# Altium schematic sheet E-18 M.2.SchDoc: FRDM-IMX93 (part 2 of 2)
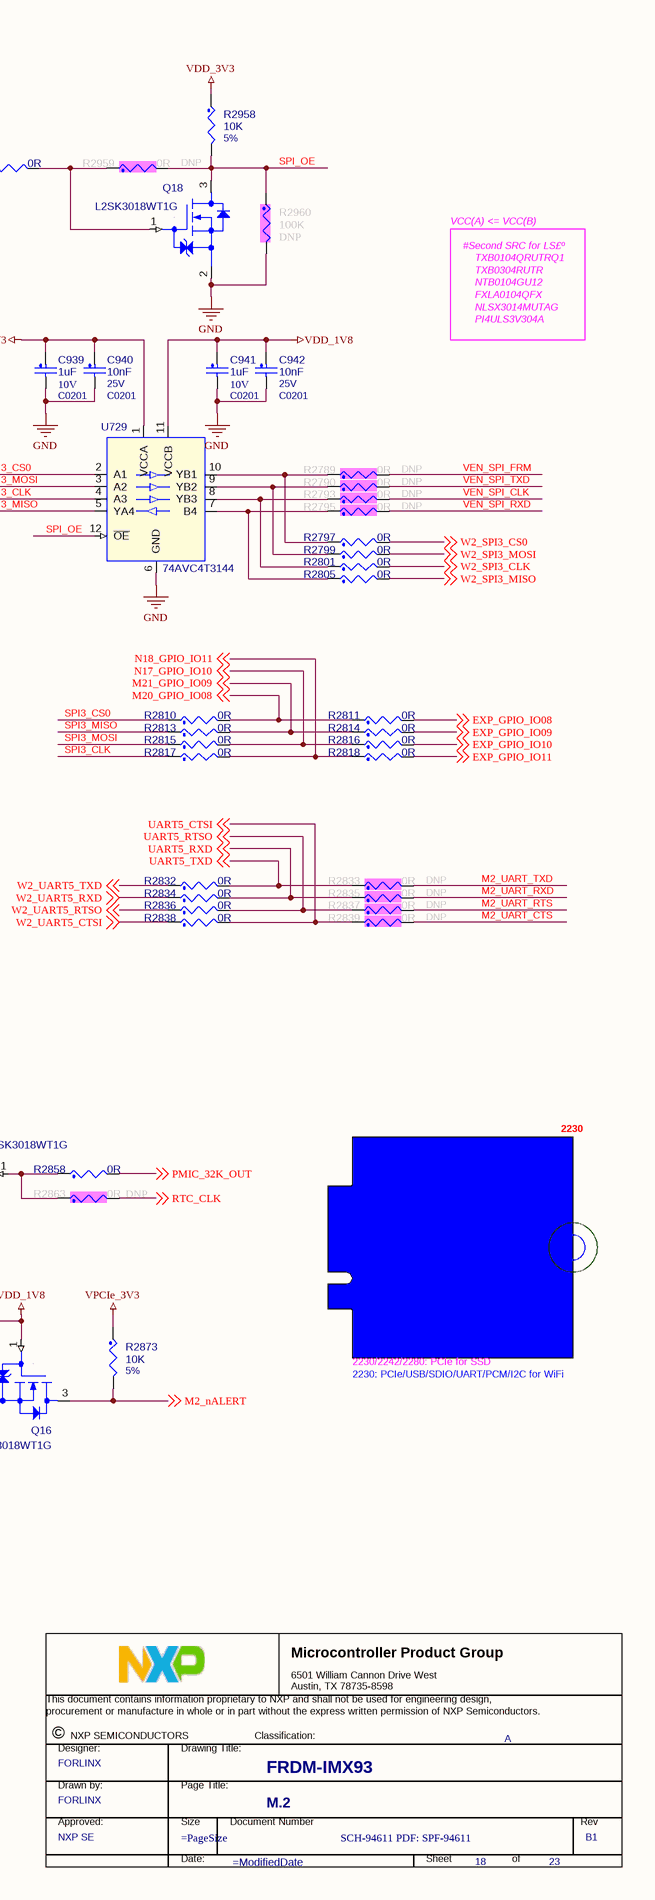
[diagram p2: E-18 M.2.SchDoc, right]

## Library data of the parts
* = TitleBlock_MCPG: Classification: Public, Company Internal/Proprietary, Company Confidential,  Company Secret; OrgName: NXP Semiconductor; OrgAddr1: NO. 192 Liangjing Rd. Pudong New Area, ShangHai; Page Size: =PageSize; Page Create Date: March  8, 1995; Designer: FORLINX; Page Modify Date: =ModifiedDate
BH1 = MOUNT_HOLE: M2mm,long 4mm; Part Reference: BH1; CLASS: IC; CAD_APPROVED: Yes; MFG_NAME01: SINHOO; MFG_PN01: M2*4mm; Value: SMTSO-M2.5-5ET; HEIGHT: 5.13MM; ROHS: Yes; PCB Footprint: mh244-166t_202h
C927 = CAP_NP: 0201,100nF,25V,+/-10%,X5R; Part Reference: C927; CLASS: DISCRETE; FPLIST: CC0402_25,CC0402_HD,0402_CC,capc0402_l; CAD_APPROVED: Yes; MFG_PN01: 0201X104K250NT; MFG_NAME01: FENGHUA; Tolerance: 10%; Value: 100nF; HEIGHT: 0.55MM; ROHS: Yes; PCB Footprint: C0201
C928 = CAP_NP: 0805,47uF,10V,+/-20%,X5R; Part Reference: C928; CLASS: DISCRETE; FPLIST: CC1210,1210_CC; CAD_APPROVED: Yes; MFG_PN01: GRM21BR61A476ME15L; MFG_NAME01: MURATA; Tolerance: 20%; Value: 47uF; Package Size: 1210; HEIGHT: 2.8MM; ROHS: Yes; PCB Footprint: C0805
C929 = CAP_NP: 0402,1nF,50V,+/-10%,X7R; Part Reference: C929; CLASS: DISCRETE; Tolerance: 5%; MFG_NAME01: FENGHUA; MFG_PN01: 0402B102K500NT; CAD_APPROVED: Yes; FPLIST: CC0402_25,CC0402_HD,0402_CC; Value: 1000pF; ROHS: Yes; HEIGHT: 0.55MM; PCB Footprint: C0402
C930 = CAP_NP: 0603,22uF,6.3V,+/-20%,X5R; Part Reference: C930; CLASS: DISCRETE; Tolerance: 20%; MFG_NAME01: SAMSUNG; MFG_PN01: CL10A226MQ8NRNC; CAD_APPROVED: Yes; FPLIST: CC0805_OV,CC0805,0805_CC; Value: 22uF; ROHS: Yes; HEIGHT: 1.45MM; PCB Footprint: C0603
C931 = CAP_NP: 0603,22uF,6.3V,+/-20%,X5R; Part Reference: C931; CLASS: DISCRETE; Tolerance: 20%; MFG_NAME01: SAMSUNG; MFG_PN01: CL10A226MQ8NRNC; CAD_APPROVED: Yes; FPLIST: CC0805_OV,CC0805,0805_CC; Value: 22uF; ROHS: Yes; HEIGHT: 1.45MM; PCB Footprint: C0603
C932 = CAP_NP: 0201,100nF,25V,+/-10%,X5R; Part Reference: C932; CLASS: DISCRETE; MFG_PN01: 0201X104K250NT; MFG_NAME01: FENGHUA; CAD_APPROVED: Yes; Tolerance: 10%; FPLIST: CC0402_25,CC0402_HD,0402_CC,capc0402_l; Value: 100nF; ROHS: Yes; HEIGHT: 0.55MM; PCB Footprint: C0201
C933 = CAP_NP: 0402,1nF,50V,+/-10%,X7R; Part Reference: C933; CLASS: DISCRETE; FPLIST: CC0402_25,CC0402_HD,0402_CC; CAD_APPROVED: Yes; MFG_PN01: 0402B102K500NT; MFG_NAME01: FENGHUA; Tolerance: 5%; Value: 1000pF; HEIGHT: 0.55MM; ROHS: Yes; PCB Footprint: C0402
C934 = CAP_NP: 0402,100nF,50V,+/-10%,X5R; Part Reference: C934; CLASS: DISCRETE; Tolerance: 10%; MFG_NAME01: FENGHUA; MFG_PN01: 0402X104K500NT; CAD_APPROVED: Yes; FPLIST: CC0402_25,CC0402_HD,0402_CC,capc0402_l; Value: 100nF; ROHS: Yes; HEIGHT: 0.55MM; PCB Footprint: C0402
C935 = CAP_NP: 0201,1uF,10V,+/-20%,X5R; Part Reference: C935; CLASS: DISCRETE; Tolerance: 10%; SIGNAL_MODEL: DEFAULT_CAPACITOR_1e+06pF_2_1; MFG_NAME01: SAMSUNG; MFG_PN01: CL03A105MP3NSNC; CAD_APPROVED: Yes; FPLIST: CC0402_25,CC0402_HD,0402_CC,capc0402_l; Value: 1uF; ROHS: Yes; HEIGHT: 0.55 MM; TOL: 10%; voltage rating: 10V; PCB Footprint: C0201
C936 = CAP_NP: 0201,10nF,25V,+/-10%,X7R; Part Reference: C936; CLASS: DISCRETE; Tolerance: 10%; MFG_NAME01: FENGHUA; MFG_PN01: 0201B103K250NT; Temp_Range: -55¡ãC - 85¡ãC; CAD_APPROVED: Yes; FPLIST: CC0402_25,CC0402_HD,0402_CC,capc0402_l; Value: 10nF; ROHS: Yes; HEIGHT: 0.55MM; PCB Footprint: C0201
C937 = CAP_NP: 0201,10nF,25V,+/-10%,X7R; Part Reference: C937; CLASS: DISCRETE; Tolerance: 10%; MFG_NAME01: FENGHUA; MFG_PN01: 0201B103K250NT; Temp_Range: -55¡ãC - 85¡ãC; CAD_APPROVED: Yes; FPLIST: CC0402_25,CC0402_HD,0402_CC,capc0402_l; Value: 10nF; ROHS: Yes; HEIGHT: 0.55MM; PCB Footprint: C0201
C938 = CAP_NP: 0201,1uF,10V,+/-20%,X5R; Part Reference: C938; CLASS: DISCRETE; Tolerance: 10%; SIGNAL_MODEL: DEFAULT_CAPACITOR_1e+06pF_2_1; MFG_NAME01: SAMSUNG; MFG_PN01: CL03A105MP3NSNC; CAD_APPROVED: Yes; FPLIST: CC0402_25,CC0402_HD,0402_CC,capc0402_l; Value: 1uF; ROHS: Yes; HEIGHT: 0.55 MM; TOL: 10%; voltage rating: 10V; PCB Footprint: C0201
C939 = CAP_NP: 0201,1uF,10V,+/-20%,X5R; Part Reference: C939; CLASS: DISCRETE; Tolerance: 10%; SIGNAL_MODEL: DEFAULT_CAPACITOR_1e+06pF_2_1; MFG_NAME01: SAMSUNG; MFG_PN01: CL03A105MP3NSNC; CAD_APPROVED: Yes; FPLIST: CC0402_25,CC0402_HD,0402_CC,capc0402_l; Value: 1uF; ROHS: Yes; HEIGHT: 0.55 MM; TOL: 10%; voltage rating: 10V; PCB Footprint: C0201
C940 = CAP_NP: 0201,10nF,25V,+/-10%,X7R; Part Reference: C940; CLASS: DISCRETE; FPLIST: CC0402_25,CC0402_HD,0402_CC; CAD_APPROVED: Yes; MFG_PN01: 0201B103K250NT; MFG_NAME01: FENGHUA; Tolerance: 10%; Value: 10nF; HEIGHT: 0.74 MM; ROHS: Yes; PCB Footprint: C0201
C941 = CAP_NP: 0201,1uF,10V,+/-20%,X5R; Part Reference: C941; CLASS: DISCRETE; Tolerance: 10%; SIGNAL_MODEL: DEFAULT_CAPACITOR_1e+06pF_2_1; MFG_NAME01: SAMSUNG; MFG_PN01: CL03A105MP3NSNC; CAD_APPROVED: Yes; FPLIST: CC0402_25,CC0402_HD,0402_CC,capc0402_l; Value: 1uF; ROHS: Yes; HEIGHT: 0.55 MM; TOL: 10%; voltage rating: 10V; PCB Footprint: C0201
C942 = CAP_NP: 0201,10nF,25V,+/-10%,X7R; Part Reference: C942; CLASS: DISCRETE; FPLIST: CC0402_25,CC0402_HD,0402_CC; CAD_APPROVED: Yes; MFG_PN01: 0201B103K250NT; MFG_NAME01: FENGHUA; Tolerance: 10%; Value: 10nF; HEIGHT: 0.74 MM; ROHS: Yes; PCB Footprint: C0201
C943 = CAP_NP: 0201,100nF,25V,+/-10%,X5R; Part Reference: C943; CLASS: DISCRETE; FPLIST: CC0402_25,CC0402_HD,0402_CC,capc0402_l; CAD_APPROVED: Yes; MFG_PN01: 0201X104K250NT; MFG_NAME01: FENGHUA; Tolerance: 10%; Value: 100nF; HEIGHT: 0.55MM; ROHS: Yes; PCB Footprint: C0201
C944 = CAP_NP: 0201,100nF,25V,+/-10%,X5R; Part Reference: C944; CLASS: DISCRETE; FPLIST: CC0402_25,CC0402_HD,0402_CC,capc0402_l; CAD_APPROVED: Yes; MFG_PN01: 0201X104K250NT; MFG_NAME01: FENGHUA; Tolerance: 10%; Value: 100nF; HEIGHT: 0.55MM; ROHS: Yes; PCB Footprint: C0201
C945 = CAP_NP: 0201,100nF,25V,+/-10%,X5R; Part Reference: C945; CLASS: DISCRETE; Tolerance: 10%; MFG_NAME01: FENGHUA; MFG_PN01: 0201X104K250NT; CAD_APPROVED: Yes; FPLIST: CC0402_25,CC0402_HD,0402_CC,capc0402_l; Value: 100nF; ROHS: Yes; HEIGHT: 0.55MM; PCB Footprint: C0201
C946 = CAP_NP: 0201,100nF,25V,+/-10%,X5R; Part Reference: C946; CLASS: DISCRETE; Tolerance: 10%; MFG_NAME01: FENGHUA; MFG_PN01: 0201X104K250NT; CAD_APPROVED: Yes; FPLIST: CC0402_25,CC0402_HD,0402_CC,capc0402_l; Value: 100nF; ROHS: Yes; HEIGHT: 0.55MM; PCB Footprint: C0201
C947 = CAP_NP: 0402,10uF,6.3V,+/-20%,X5R; Part Reference: C947; CLASS: DISCRETE; FPLIST: CC0603_OV,CC0603,0603_CC_NSP; CAD_APPROVED: Yes; Temp_Range: -55¡ãC ~ 85¡ãC; MFG_PN01: 0402X106M6R3NT; MFG_NAME01: FENGHUA; Tolerance: 20%; Value: 10uF; HEIGHT: 1MM; ROHS: Yes; Package Size: 0603; Package Type: SMD; PCB Footprint: C0402
C948 = CAP_NP: 1206,100uF,6.3V,+/-20%,X5R; Part Reference: C948; CLASS: DISCRETE; Tolerance: 20%; MFG_NAME01: SAMSUNG; MFG_PN01: CL31A107MQHNNNE; CAD_APPROVED: Yes; FPLIST: CC1210,1210_CC; Value: 100uF; ROHS: Yes; HEIGHT: 2.8MM; Package Size: 1210; PCB Footprint: C1206
C949 = CAP_NP: 1206,100uF,6.3V,+/-20%,X5R; Part Reference: C949; CLASS: DISCRETE; Tolerance: 20%; MFG_NAME01: SAMSUNG; MFG_PN01: CL31A107MQHNNNE; CAD_APPROVED: Yes; FPLIST: CC1210,1210_CC; Value: 100uF; ROHS: Yes; HEIGHT: 2.8MM; Package Size: 1210; PCB Footprint: C1206
C950 = CAP_NP: 1206,100uF,6.3V,+/-20%,X5R; Part Reference: C950; CLASS: DISCRETE; Tolerance: 20%; MFG_NAME01: SAMSUNG; MFG_PN01: CL31A107MQHNNNE; CAD_APPROVED: Yes; FPLIST: CC1210,1210_CC; Value: 100uF; ROHS: Yes; HEIGHT: 2.8MM; Package Size: 1210; PCB Footprint: C1206
D613 = LED: LED GRN SGL 25MA SMT 0603; Part Reference: D613; CLASS: IC; MFG_NAME01: Harvatek; MFG_PN01: HQ19-2132UBGC82(Y); CAD_APPROVED: Yes; VOLTAGE: 2V; Value: LED GREEN; ROHS: Yes; HEIGHT: 0.8 MM; PCB Footprint: led0603
D614 = LED: LED BLUE SGL 20MA SMT 0603; Part Reference: D614; CLASS: IC; MFG_NAME01: Harvatek; MFG_PN01: HQ19-2132UBC83 (Y); Temp_Range: -40¡ãC to +85¡ãC; CAD_APPROVED: Yes; Rated Voltage: 2V; Value: LED_ORANGE; ROHS: Yes; HEIGHT: 0.28MM; VOLTAGE: 2v; Temp Range: -40¡ãC to +85¡ãC; PCB Footprint: led0603
L711 = INDUCTOR: 0.47uh, 2.5*2.0*1.0mm ,4.4A; Part Reference: L711; PART_TYPE: INDUCTOR\POWER; CLASS: DISCRETE; TOL: 20%; MFG_NAME01: Sunlord; MFG_PN01: WPN252012ER47MT; Temp_Range: -40¡ãC to +125¡ãC; CAD_APPROVED: Yes; Value: 0.47uH; ROHS: Yes; HEIGHT: 1.2MM; Tolerance: 20%; PCB Footprint: ind_sph2520
P8 = CON_67_FEMALE_RA_B: AP-APC1037-1,M.2,0.5PITCH,5.5mm,Support height of 3.9mm,KEY-E; Part Reference: P8; CLASS: IO; CAD_APPROVED: Yes; MFG_NAME01: LOTES; 3D_Mechanical_Footprint_File: ftp://fcl.am.freescale.net/ALLEGRO/step/con67_0p5_type-e_22x7p3_ra_270h.STEP; Value: M.2 SKT KEY-E; Package Size: 22.0 x 7.3 x 6.85 mm; HEIGHT: 6.85MM; Package Type: SMD/SMT; ROHS: Yes; MFG_PN01: AP-APC1037-1; PCB Footprint: con_75_0p5_22x9_ra1
Q8 = NX3008NBKW_SOT323: Part Reference: Q8; CLASS: IC; MFG_NAME01: LRC; CAD_APPROVED: Yes; Value: L2SK3018WT1G; MFG_PN01: L2SK3018WT1G; ROHS: Yes; HEIGHT: 1.1MM; PCB Footprint: sc70_3
Q16 = NX3008NBKW_SOT323: Part Reference: Q16; CLASS: IC; CAD_APPROVED: Yes; MFG_NAME01: LRC; Value: L2SK3018WT1G; HEIGHT: 1.1MM; ROHS: Yes; MFG_PN01: L2SK3018WT1G; PCB Footprint: sc70_3
Q17 = NX3008NBKW_SOT323: Part Reference: Q17; CLASS: IC; CAD_APPROVED: Yes; MFG_NAME01: LRC; Value: L2SK3018WT1G; HEIGHT: 1.1MM; ROHS: Yes; MFG_PN01: L2SK3018WT1G; PCB Footprint: sc70_3
Q18 = NX3008NBKW_SOT323: Part Reference: Q18; CLASS: IC; MFG_NAME01: LRC; CAD_APPROVED: Yes; Value: L2SK3018WT1G; MFG_PN01: L2SK3018WT1G; ROHS: Yes; HEIGHT: 1.1MM; PCB Footprint: sc70_3
R2776 = RES: 0402,187K,+/-1%; Part Reference: R2776; CLASS: DISCRETE; FPLIST: RC0402_25,RC0402_HD,0402_CC; CAD_APPROVED: Yes; Temp_Range: -55C to +155C; MFG_PN01: RC-02W1873FT; MFG_NAME01: FENGHUA; Value: 187K; HEIGHT: 0.40 MM; ROHS: Yes; PCB Footprint: R0402
R2781 = RES: 0201,1K,+/-1%; Part Reference: R2781; CLASS: DISCRETE; FPLIST: RC0402_25,RC0402_HD,RC0402_X2,0402_CC,CAPC0402_L; CAD_APPROVED: Yes; MFG_PN01: RC-01W1001FT; MFG_NAME01: FENGHUA; Value: 1K; ROHS: Yes; HEIGHT: 0.41mm; PCB Footprint: R0201
R2782 = RES: 0201,1K,+/-1%; Part Reference: R2782; CLASS: DISCRETE; MFG_NAME01: FENGHUA; MFG_PN01: RC-01W1001FT; CAD_APPROVED: Yes; FPLIST: RC0402_25,RC0402_HD,RC0402_X2,0402_CC,CAPC0402_L; Value: 1K; HEIGHT: 0.41mm; ROHS: Yes; PCB Footprint: R0201
R2783 = RES: 0201,10K,+/-5%; Part Reference: R2783; CLASS: DISCRETE; FPLIST: RC0402_25,RC0402_HD,0402_CC; CAD_APPROVED: Yes; MFG_PN01: RC-01W103JT; MFG_NAME01: FENGHUA; Value: 10K; HEIGHT: 0.4 MM; ROHS: Yes; PCB Footprint: R0201
R2784 = RES: 0402,41.2K,+/-1%; Part Reference: R2784; CLASS: DISCRETE; MFG_NAME01: FENGHUA; MFG_PN01: RC-02W4122FT; Temp_Range: -55C to +155C; CAD_APPROVED: Yes; FPLIST: RC0402_25,RC0402_HD,0402_CC; Value: 41.2K; ROHS: Yes; HEIGHT: 0.40 MM; PCB Footprint: R0402
R2785 = RES: 0201,1K,+/-1%; Part Reference: R2785; CLASS: DISCRETE; FPLIST: RC0402_25,RC0402_HD,RC0402_X2,0402_CC,CAPC0402_L; CAD_APPROVED: Yes; MFG_PN01: RC-01W1001FT; MFG_NAME01: FENGHUA; Value: 1K; ROHS: Yes; HEIGHT: 0.41mm; PCB Footprint: R0201
R2786 = RES: 0201,100K,+/-1%; Part Reference: R2786; CLASS: DISCRETE; Temp_Range: -55C to +155C; FPLIST: RC0402_25,RC0402_HD,0402_CC; CAD_APPROVED: Yes; MFG_PN01: RC-01W1003FT; MFG_NAME01: FENGHUA; VOLTAGE: 50V; Value: 100K; HEIGHT: 0.40 MM; ROHS: Yes; Temp Range: -55C to +155C; PCB Footprint: R0201
R2788 = RES: 0402,0Ohm,+/-1%; Part Reference: R2788; CLASS: DISCRETE; FPLIST: RC0402_25,RC0402_HD,RC0402_X2,0402_CC; CAD_APPROVED: Yes; MFG_PN01: RC-02000FT; MFG_NAME01: FENGHUA; Tolerance: 5%; VOLTAGE: 1/16W; Value: 0R; ROHS: Yes; HEIGHT: 0.45 MM; PCB Footprint: R0402
R2789 = RES: 0402,0Ohm,+/-1%; Part Reference: R2789; CLASS: DISCRETE; FPLIST: RC0402_25,RC0402_HD,RC0402_X2,0402_CC; CAD_APPROVED: Yes; MFG_PN01: RC-02000FT; MFG_NAME01: FENGHUA; Tolerance: 5%; VOLTAGE: 1/16W; Value: 0R; ROHS: Yes; HEIGHT: 0.45 MM; PCB Footprint: R0402
R2790 = RES: 0402,0Ohm,+/-1%; Part Reference: R2790; CLASS: DISCRETE; VOLTAGE: 1/16W; Tolerance: 5%; MFG_NAME01: FENGHUA; MFG_PN01: RC-02000FT; CAD_APPROVED: Yes; FPLIST: RC0402_25,RC0402_HD,RC0402_X2,0402_CC; Value: 0R; HEIGHT: 0.45 MM; ROHS: Yes; PCB Footprint: R0402
R2791 = RES: 0402,0Ohm,+/-1%; Part Reference: R2791; CLASS: DISCRETE; VOLTAGE: 1/16W; Tolerance: 5%; MFG_NAME01: FENGHUA; MFG_PN01: RC-02000FT; CAD_APPROVED: Yes; FPLIST: RC0402_25,RC0402_HD,RC0402_X2,0402_CC; Value: 0R; HEIGHT: 0.45 MM; ROHS: Yes; PCB Footprint: R0402
R2792 = RES: 0402,0Ohm,+/-1%; Part Reference: R2792; CLASS: DISCRETE; VOLTAGE: 1/16W; Tolerance: 5%; MFG_NAME01: FENGHUA; MFG_PN01: RC-02000FT; CAD_APPROVED: Yes; FPLIST: RC0402_25,RC0402_HD,RC0402_X2,0402_CC; Value: 0R; HEIGHT: 0.45 MM; ROHS: Yes; PCB Footprint: R0402
R2793 = RES: 0402,0Ohm,+/-1%; Part Reference: R2793; CLASS: DISCRETE; FPLIST: RC0402_25,RC0402_HD,RC0402_X2,0402_CC; CAD_APPROVED: Yes; MFG_PN01: RC-02000FT; MFG_NAME01: FENGHUA; Tolerance: 5%; VOLTAGE: 1/16W; Value: 0R; ROHS: Yes; HEIGHT: 0.45 MM; PCB Footprint: R0402
R2794 = RES: 0402,0Ohm,+/-1%; Part Reference: R2794; CLASS: DISCRETE; VOLTAGE: 1/16W; Tolerance: 5%; MFG_NAME01: FENGHUA; MFG_PN01: RC-02000FT; CAD_APPROVED: Yes; FPLIST: RC0402_25,RC0402_HD,RC0402_X2,0402_CC; Value: 0R; HEIGHT: 0.45 MM; ROHS: Yes; PCB Footprint: R0402
R2795 = RES: 0402,0Ohm,+/-1%; Part Reference: R2795; CLASS: DISCRETE; FPLIST: RC0402_25,RC0402_HD,RC0402_X2,0402_CC; CAD_APPROVED: Yes; MFG_PN01: RC-02000FT; MFG_NAME01: FENGHUA; Tolerance: 5%; VOLTAGE: 1/16W; Value: 0R; ROHS: Yes; HEIGHT: 0.45 MM; PCB Footprint: R0402
R2796 = RES: 0402,0Ohm,+/-1%; Part Reference: R2796; CLASS: DISCRETE; FPLIST: RC0402_25,RC0402_HD,RC0402_X2,0402_CC; CAD_APPROVED: Yes; MFG_PN01: RC-02000FT; MFG_NAME01: FENGHUA; Tolerance: 5%; VOLTAGE: 1/16W; Value: 0R; ROHS: Yes; HEIGHT: 0.45 MM; PCB Footprint: R0402
R2797 = RES: 0402,0Ohm,+/-1%; Part Reference: R2797; CLASS: DISCRETE; VOLTAGE: 1/16W; Tolerance: 5%; MFG_NAME01: FENGHUA; MFG_PN01: RC-02000FT; CAD_APPROVED: Yes; FPLIST: RC0402_25,RC0402_HD,RC0402_X2,0402_CC; Value: 0R; HEIGHT: 0.45 MM; ROHS: Yes; PCB Footprint: R0402
R2798 = RES: 0402,0Ohm,+/-1%; Part Reference: R2798; CLASS: DISCRETE; FPLIST: RC0402_25,RC0402_HD,RC0402_X2,0402_CC; CAD_APPROVED: Yes; MFG_PN01: RC-02000FT; MFG_NAME01: FENGHUA; Tolerance: 5%; VOLTAGE: 1/16W; Value: 0R; ROHS: Yes; HEIGHT: 0.45 MM; PCB Footprint: R0402
R2799 = RES: 0402,0Ohm,+/-1%; Part Reference: R2799; CLASS: DISCRETE; FPLIST: RC0402_25,RC0402_HD,RC0402_X2,0402_CC; CAD_APPROVED: Yes; MFG_PN01: RC-02000FT; MFG_NAME01: FENGHUA; Tolerance: 5%; VOLTAGE: 1/16W; Value: 0R; ROHS: Yes; HEIGHT: 0.45 MM; PCB Footprint: R0402
R2800 = RES: 0402,0Ohm,+/-1%; Part Reference: R2800; CLASS: DISCRETE; FPLIST: RC0402_25,RC0402_HD,RC0402_X2,0402_CC; CAD_APPROVED: Yes; MFG_PN01: RC-02000FT; MFG_NAME01: FENGHUA; Tolerance: 5%; VOLTAGE: 1/16W; Value: 0R; ROHS: Yes; HEIGHT: 0.45 MM; PCB Footprint: R0402
R2801 = RES: 0402,0Ohm,+/-1%; Part Reference: R2801; CLASS: DISCRETE; FPLIST: RC0402_25,RC0402_HD,RC0402_X2,0402_CC; CAD_APPROVED: Yes; MFG_PN01: RC-02000FT; MFG_NAME01: FENGHUA; Tolerance: 5%; VOLTAGE: 1/16W; Value: 0R; ROHS: Yes; HEIGHT: 0.45 MM; PCB Footprint: R0402
R2802 = RES: 0402,0Ohm,+/-1%; Part Reference: R2802; CLASS: DISCRETE; FPLIST: RC0402_25,RC0402_HD,RC0402_X2,0402_CC; CAD_APPROVED: Yes; MFG_PN01: RC-02000FT; MFG_NAME01: FENGHUA; Tolerance: 5%; VOLTAGE: 1/16W; Value: 0R; ROHS: Yes; HEIGHT: 0.45 MM; PCB Footprint: R0402
R2803 = RES: 0402,0Ohm,+/-1%; Part Reference: R2803; CLASS: DISCRETE; VOLTAGE: 1/16W; Tolerance: 5%; MFG_NAME01: FENGHUA; MFG_PN01: RC-02000FT; CAD_APPROVED: Yes; FPLIST: RC0402_25,RC0402_HD,RC0402_X2,0402_CC; Value: 0R; HEIGHT: 0.45 MM; ROHS: Yes; PCB Footprint: R0402
R2804 = RES: 0402,0Ohm,+/-1%; Part Reference: R2804; CLASS: DISCRETE; VOLTAGE: 1/16W; Tolerance: 5%; MFG_NAME01: FENGHUA; MFG_PN01: RC-02000FT; CAD_APPROVED: Yes; FPLIST: RC0402_25,RC0402_HD,RC0402_X2,0402_CC; Value: 0R; HEIGHT: 0.45 MM; ROHS: Yes; PCB Footprint: R0402
R2805 = RES: 0402,0Ohm,+/-1%; Part Reference: R2805; CLASS: DISCRETE; VOLTAGE: 1/16W; Tolerance: 5%; MFG_NAME01: FENGHUA; MFG_PN01: RC-02000FT; CAD_APPROVED: Yes; FPLIST: RC0402_25,RC0402_HD,RC0402_X2,0402_CC; Value: 0R; HEIGHT: 0.45 MM; ROHS: Yes; PCB Footprint: R0402
R2806 = RES: 0402,0Ohm,+/-1%; Part Reference: R2806; CLASS: DISCRETE; VOLTAGE: 1/16W; Tolerance: 5%; MFG_NAME01: FENGHUA; MFG_PN01: RC-02000FT; CAD_APPROVED: Yes; FPLIST: RC0402_25,RC0402_HD,RC0402_X2,0402_CC; Value: 0R; HEIGHT: 0.45 MM; ROHS: Yes; PCB Footprint: R0402
R2807 = RES: 0402,0Ohm,+/-1%; Part Reference: R2807; CLASS: DISCRETE; VOLTAGE: 1/16W; Tolerance: 5%; MFG_NAME01: FENGHUA; MFG_PN01: RC-02000FT; CAD_APPROVED: Yes; FPLIST: RC0402_25,RC0402_HD,RC0402_X2,0402_CC; Value: 0R; HEIGHT: 0.45 MM; ROHS: Yes; PCB Footprint: R0402
R2808 = RES: 0402,0Ohm,+/-1%; Part Reference: R2808; CLASS: DISCRETE; FPLIST: RC0402_25,RC0402_HD,RC0402_X2,0402_CC; CAD_APPROVED: Yes; MFG_PN01: RC-02000FT; MFG_NAME01: FENGHUA; Tolerance: 5%; VOLTAGE: 1/16W; Value: 0R; ROHS: Yes; HEIGHT: 0.45 MM; PCB Footprint: R0402
R2809 = RES: 0402,0Ohm,+/-1%; Part Reference: R2809; CLASS: DISCRETE; FPLIST: RC0402_25,RC0402_HD,RC0402_X2,0402_CC; CAD_APPROVED: Yes; MFG_PN01: RC-02000FT; MFG_NAME01: FENGHUA; Tolerance: 5%; VOLTAGE: 1/16W; Value: 0R; ROHS: Yes; HEIGHT: 0.45 MM; PCB Footprint: R0402
R2810 = RES: 0402,0Ohm,+/-1%; Part Reference: R2810; CLASS: DISCRETE; FPLIST: RC0402_25,RC0402_HD,RC0402_X2,0402_CC; CAD_APPROVED: Yes; MFG_PN01: RC-02000FT; MFG_NAME01: FENGHUA; Tolerance: 5%; VOLTAGE: 1/16W; Value: 0R; ROHS: Yes; HEIGHT: 0.45 MM; PCB Footprint: R0402
R2811 = RES: 0402,0Ohm,+/-1%; Part Reference: R2811; CLASS: DISCRETE; FPLIST: RC0402_25,RC0402_HD,RC0402_X2,0402_CC; CAD_APPROVED: Yes; MFG_PN01: RC-02000FT; MFG_NAME01: FENGHUA; Tolerance: 5%; VOLTAGE: 1/16W; Value: 0R; ROHS: Yes; HEIGHT: 0.45 MM; PCB Footprint: R0402
R2812 = RES: 0402,0Ohm,+/-1%; Part Reference: R2812; CLASS: DISCRETE; FPLIST: RC0402_25,RC0402_HD,RC0402_X2,0402_CC; CAD_APPROVED: Yes; MFG_PN01: RC-02000FT; MFG_NAME01: FENGHUA; Tolerance: 5%; VOLTAGE: 1/16W; Value: 0R; ROHS: Yes; HEIGHT: 0.45 MM; PCB Footprint: R0402
R2813 = RES: 0402,0Ohm,+/-1%; Part Reference: R2813; CLASS: DISCRETE; VOLTAGE: 1/16W; Tolerance: 5%; MFG_NAME01: FENGHUA; MFG_PN01: RC-02000FT; CAD_APPROVED: Yes; FPLIST: RC0402_25,RC0402_HD,RC0402_X2,0402_CC; Value: 0R; HEIGHT: 0.45 MM; ROHS: Yes; PCB Footprint: R0402
R2814 = RES: 0402,0Ohm,+/-1%; Part Reference: R2814; CLASS: DISCRETE; VOLTAGE: 1/16W; Tolerance: 5%; MFG_NAME01: FENGHUA; MFG_PN01: RC-02000FT; CAD_APPROVED: Yes; FPLIST: RC0402_25,RC0402_HD,RC0402_X2,0402_CC; Value: 0R; HEIGHT: 0.45 MM; ROHS: Yes; PCB Footprint: R0402
R2815 = RES: 0402,0Ohm,+/-1%; Part Reference: R2815; CLASS: DISCRETE; VOLTAGE: 1/16W; Tolerance: 5%; MFG_NAME01: FENGHUA; MFG_PN01: RC-02000FT; CAD_APPROVED: Yes; FPLIST: RC0402_25,RC0402_HD,RC0402_X2,0402_CC; Value: 0R; HEIGHT: 0.45 MM; ROHS: Yes; PCB Footprint: R0402
R2816 = RES: 0402,0Ohm,+/-1%; Part Reference: R2816; CLASS: DISCRETE; VOLTAGE: 1/16W; Tolerance: 5%; MFG_NAME01: FENGHUA; MFG_PN01: RC-02000FT; CAD_APPROVED: Yes; FPLIST: RC0402_25,RC0402_HD,RC0402_X2,0402_CC; Value: 0R; HEIGHT: 0.45 MM; ROHS: Yes; PCB Footprint: R0402
R2817 = RES: 0402,0Ohm,+/-1%; Part Reference: R2817; CLASS: DISCRETE; VOLTAGE: 1/16W; Tolerance: 5%; MFG_NAME01: FENGHUA; MFG_PN01: RC-02000FT; CAD_APPROVED: Yes; FPLIST: RC0402_25,RC0402_HD,RC0402_X2,0402_CC; Value: 0R; HEIGHT: 0.45 MM; ROHS: Yes; PCB Footprint: R0402
R2818 = RES: 0402,0Ohm,+/-1%; Part Reference: R2818; CLASS: DISCRETE; VOLTAGE: 1/16W; Tolerance: 5%; MFG_NAME01: FENGHUA; MFG_PN01: RC-02000FT; CAD_APPROVED: Yes; FPLIST: RC0402_25,RC0402_HD,RC0402_X2,0402_CC; Value: 0R; HEIGHT: 0.45 MM; ROHS: Yes; PCB Footprint: R0402
R2819 = RES: 0402,0Ohm,+/-1%; Part Reference: R2819; CLASS: DISCRETE; FPLIST: RC0402_25,RC0402_HD,RC0402_X2,0402_CC; CAD_APPROVED: Yes; MFG_PN01: RC-02000FT; MFG_NAME01: FENGHUA; Tolerance: 5%; VOLTAGE: 1/16W; Value: 0R; ROHS: Yes; HEIGHT: 0.45 MM; PCB Footprint: R0402
R2820 = RES: 0402,0Ohm,+/-1%; Part Reference: R2820; CLASS: DISCRETE; VOLTAGE: 1/16W; Tolerance: 5%; MFG_NAME01: FENGHUA; MFG_PN01: RC-02000FT; CAD_APPROVED: Yes; FPLIST: RC0402_25,RC0402_HD,RC0402_X2,0402_CC; Value: 0R; HEIGHT: 0.45 MM; ROHS: Yes; PCB Footprint: R0402
R2821 = RES: 0402,0Ohm,+/-1%; Part Reference: R2821; CLASS: DISCRETE; FPLIST: RC0402_25,RC0402_HD,RC0402_X2,0402_CC; CAD_APPROVED: Yes; MFG_PN01: RC-02000FT; MFG_NAME01: FENGHUA; Tolerance: 5%; VOLTAGE: 1/16W; Value: 0R; ROHS: Yes; HEIGHT: 0.45 MM; PCB Footprint: R0402
R2822 = RES: 0402,10K,+/-1%; Part Reference: R2822; CLASS: DISCRETE; FPLIST: RC0402_25,RC0402_HD,0402_CC; CAD_APPROVED: Yes; MFG_PN01: RC-02W1002FT; MFG_NAME01: FENGHUA; Value: 10K; HEIGHT: 0.4 MM; ROHS: Yes; PCB Footprint: R0402
R2823 = RES: 0402,10K,+/-1%; Part Reference: R2823; CLASS: DISCRETE; FPLIST: RC0402_25,RC0402_HD,0402_CC; CAD_APPROVED: Yes; MFG_PN01: RC-02W1002FT; MFG_NAME01: FENGHUA; Value: 10K; HEIGHT: 0.4 MM; ROHS: Yes; PCB Footprint: R0402
R2824 = RES: 0402,0Ohm,+/-1%; Part Reference: R2824; CLASS: DISCRETE; VOLTAGE: 1/16W; Tolerance: 5%; MFG_NAME01: FENGHUA; MFG_PN01: RC-02000FT; CAD_APPROVED: Yes; FPLIST: RC0402_25,RC0402_HD,RC0402_X2,0402_CC; Value: 0R; HEIGHT: 0.45 MM; ROHS: Yes; PCB Footprint: R0402
R2825 = RES: 0402,0Ohm,+/-1%; Part Reference: R2825; CLASS: DISCRETE; VOLTAGE: 1/16W; Tolerance: 5%; MFG_NAME01: FENGHUA; MFG_PN01: RC-02000FT; CAD_APPROVED: Yes; FPLIST: RC0402_25,RC0402_HD,RC0402_X2,0402_CC; Value: 0R; HEIGHT: 0.45 MM; ROHS: Yes; PCB Footprint: R0402
R2826 = RES: 0402,0Ohm,+/-1%; Part Reference: R2826; CLASS: DISCRETE; VOLTAGE: 1/16W; Tolerance: 5%; MFG_NAME01: FENGHUA; MFG_PN01: RC-02000FT; CAD_APPROVED: Yes; FPLIST: RC0402_25,RC0402_HD,RC0402_X2,0402_CC; Value: 0R; HEIGHT: 0.45 MM; ROHS: Yes; PCB Footprint: R0402
R2827 = RES: 0402,0Ohm,+/-1%; Part Reference: R2827; CLASS: DISCRETE; VOLTAGE: 1/16W; Tolerance: 5%; MFG_NAME01: FENGHUA; MFG_PN01: RC-02000FT; CAD_APPROVED: Yes; FPLIST: RC0402_25,RC0402_HD,RC0402_X2,0402_CC; Value: 0R; HEIGHT: 0.45 MM; ROHS: Yes; PCB Footprint: R0402
R2828 = RES: 0402,0Ohm,+/-1%; Part Reference: R2828; CLASS: DISCRETE; VOLTAGE: 1/16W; Tolerance: 5%; MFG_NAME01: FENGHUA; MFG_PN01: RC-02000FT; CAD_APPROVED: Yes; FPLIST: RC0402_25,RC0402_HD,RC0402_X2,0402_CC; Value: 0R; HEIGHT: 0.45 MM; ROHS: Yes; PCB Footprint: R0402
R2829 = RES: 0402,0Ohm,+/-1%; Part Reference: R2829; CLASS: DISCRETE; VOLTAGE: 1/16W; Tolerance: 5%; MFG_NAME01: FENGHUA; MFG_PN01: RC-02000FT; CAD_APPROVED: Yes; FPLIST: RC0402_25,RC0402_HD,RC0402_X2,0402_CC; Value: 0R; HEIGHT: 0.45 MM; ROHS: Yes; PCB Footprint: R0402
R2830 = RES: 0402,0Ohm,+/-1%; Part Reference: R2830; CLASS: DISCRETE; VOLTAGE: 1/16W; Tolerance: 5%; MFG_NAME01: FENGHUA; MFG_PN01: RC-02000FT; CAD_APPROVED: Yes; FPLIST: RC0402_25,RC0402_HD,RC0402_X2,0402_CC; Value: 0R; HEIGHT: 0.45 MM; ROHS: Yes; PCB Footprint: R0402
R2831 = RES: 0201,1K,+/-1%; Part Reference: R2831; CLASS: DISCRETE; FPLIST: RC0402_25,RC0402_HD,RC0402_X2,0402_CC,CAPC0402_L; CAD_APPROVED: Yes; MFG_PN01: RC-01W1001FT; MFG_NAME01: FENGHUA; Value: 1K; ROHS: Yes; HEIGHT: 0.41mm; PCB Footprint: R0201
R2832 = RES: 0402,0Ohm,+/-1%; Part Reference: R2832; CLASS: DISCRETE; VOLTAGE: 1/16W; Tolerance: 5%; MFG_NAME01: FENGHUA; MFG_PN01: RC-02000FT; CAD_APPROVED: Yes; FPLIST: RC0402_25,RC0402_HD,RC0402_X2,0402_CC; Value: 0R; HEIGHT: 0.45 MM; ROHS: Yes; PCB Footprint: R0402
R2833 = RES: 0402,0Ohm,+/-1%; Part Reference: R2833; CLASS: DISCRETE; VOLTAGE: 1/16W; Tolerance: 5%; MFG_NAME01: FENGHUA; MFG_PN01: RC-02000FT; CAD_APPROVED: Yes; FPLIST: RC0402_25,RC0402_HD,RC0402_X2,0402_CC; Value: 0R; HEIGHT: 0.45 MM; ROHS: Yes; PCB Footprint: R0402
R2834 = RES: 0402,0Ohm,+/-1%; Part Reference: R2834; CLASS: DISCRETE; FPLIST: RC0402_25,RC0402_HD,RC0402_X2,0402_CC; CAD_APPROVED: Yes; MFG_PN01: RC-02000FT; MFG_NAME01: FENGHUA; Tolerance: 5%; VOLTAGE: 1/16W; Value: 0R; ROHS: Yes; HEIGHT: 0.45 MM; PCB Footprint: R0402
R2835 = RES: 0402,0Ohm,+/-1%; Part Reference: R2835; CLASS: DISCRETE; VOLTAGE: 1/16W; Tolerance: 5%; MFG_NAME01: FENGHUA; MFG_PN01: RC-02000FT; CAD_APPROVED: Yes; FPLIST: RC0402_25,RC0402_HD,RC0402_X2,0402_CC; Value: 0R; HEIGHT: 0.45 MM; ROHS: Yes; PCB Footprint: R0402
R2836 = RES: 0402,0Ohm,+/-1%; Part Reference: R2836; CLASS: DISCRETE; FPLIST: RC0402_25,RC0402_HD,RC0402_X2,0402_CC; CAD_APPROVED: Yes; MFG_PN01: RC-02000FT; MFG_NAME01: FENGHUA; Tolerance: 5%; VOLTAGE: 1/16W; Value: 0R; ROHS: Yes; HEIGHT: 0.45 MM; PCB Footprint: R0402
R2837 = RES: 0402,0Ohm,+/-1%; Part Reference: R2837; CLASS: DISCRETE; VOLTAGE: 1/16W; Tolerance: 5%; MFG_NAME01: FENGHUA; MFG_PN01: RC-02000FT; CAD_APPROVED: Yes; FPLIST: RC0402_25,RC0402_HD,RC0402_X2,0402_CC; Value: 0R; HEIGHT: 0.45 MM; ROHS: Yes; PCB Footprint: R0402
R2838 = RES: 0402,0Ohm,+/-1%; Part Reference: R2838; CLASS: DISCRETE; VOLTAGE: 1/16W; Tolerance: 5%; MFG_NAME01: FENGHUA; MFG_PN01: RC-02000FT; CAD_APPROVED: Yes; FPLIST: RC0402_25,RC0402_HD,RC0402_X2,0402_CC; Value: 0R; HEIGHT: 0.45 MM; ROHS: Yes; PCB Footprint: R0402
R2839 = RES: 0402,0Ohm,+/-1%; Part Reference: R2839; CLASS: DISCRETE; VOLTAGE: 1/16W; Tolerance: 5%; MFG_NAME01: FENGHUA; MFG_PN01: RC-02000FT; CAD_APPROVED: Yes; FPLIST: RC0402_25,RC0402_HD,RC0402_X2,0402_CC; Value: 0R; HEIGHT: 0.45 MM; ROHS: Yes; PCB Footprint: R0402
R2840 = RES: 0201,1K,+/-1%; Part Reference: R2840; CLASS: DISCRETE; MFG_NAME01: FENGHUA; MFG_PN01: RC-01W1001FT; CAD_APPROVED: Yes; FPLIST: RC0402_25,RC0402_HD,RC0402_X2,0402_CC,CAPC0402_L; Value: 1K; HEIGHT: 0.41mm; ROHS: Yes; PCB Footprint: R0201
R2841 = RES: 0402,0Ohm,+/-1%; Part Reference: R2841; CLASS: DISCRETE; FPLIST: RC0402_25,RC0402_HD,RC0402_X2,0402_CC; CAD_APPROVED: Yes; MFG_PN01: RC-02000FT; MFG_NAME01: FENGHUA; Tolerance: 5%; VOLTAGE: 1/16W; Value: 0R; ROHS: Yes; HEIGHT: 0.45 MM; PCB Footprint: R0402
R2850 = RES: 0402,4.7K,+/-1%; Part Reference: R2850; CLASS: DISCRETE; FPLIST: RC0402_25,RC0402_HD,0402_CC,RC0402_X2; CAD_APPROVED: Yes; MFG_PN01: RC-02K4701FT; MFG_NAME01: FENGHUA; Value: 4.7K; HEIGHT: 0.41mm; ROHS: Yes; PCB Footprint: R0402
R2851 = RES: 0402,0Ohm,+/-1%; Part Reference: R2851; CLASS: DISCRETE; VOLTAGE: 1/16W; Tolerance: 5%; MFG_NAME01: FENGHUA; MFG_PN01: RC-02000FT; CAD_APPROVED: Yes; FPLIST: RC0402_25,RC0402_HD,RC0402_X2,0402_CC; Value: 0R; HEIGHT: 0.45 MM; ROHS: Yes; PCB Footprint: R0402
R2852 = RES: 0201,0Ohm,+/-5%; Part Reference: R2852; CLASS: DISCRETE; VOLTAGE: 1/16W; Tolerance: 5%; MFG_NAME01: FENGHUA; MFG_PN01: RC-01000JT; CAD_APPROVED: Yes; FPLIST: RC0402_25,RC0402_HD,RC0402_X2,0402_CC; Value: 0R; HEIGHT: 0.45 MM; ROHS: Yes; PCB Footprint: R0201
R2853 = RES: 0402,0Ohm,+/-1%; Part Reference: R2853; CLASS: DISCRETE; FPLIST: RC0402_25,RC0402_HD,RC0402_X2,0402_CC; CAD_APPROVED: Yes; MFG_PN01: RC-02000FT; MFG_NAME01: FENGHUA; Tolerance: 5%; VOLTAGE: 1/16W; Value: 0R; ROHS: Yes; HEIGHT: 0.45 MM; PCB Footprint: R0402
R2854 = RES: 0402,0Ohm,+/-1%; Part Reference: R2854; CLASS: DISCRETE; VOLTAGE: 1/16W; Tolerance: 5%; MFG_NAME01: FENGHUA; MFG_PN01: RC-02000FT; CAD_APPROVED: Yes; FPLIST: RC0402_25,RC0402_HD,RC0402_X2,0402_CC; Value: 0R; HEIGHT: 0.45 MM; ROHS: Yes; PCB Footprint: R0402
R2855 = RES: 0402,0Ohm,+/-1%; Part Reference: R2855; CLASS: DISCRETE; VOLTAGE: 1/16W; Tolerance: 5%; MFG_NAME01: FENGHUA; MFG_PN01: RC-02000FT; CAD_APPROVED: Yes; FPLIST: RC0402_25,RC0402_HD,RC0402_X2,0402_CC; Value: 0R; HEIGHT: 0.45 MM; ROHS: Yes; PCB Footprint: R0402
R2856 = RES: 0201,0Ohm,+/-5%; Part Reference: R2856; CLASS: DISCRETE; FPLIST: RC0402_25,RC0402_HD,RC0402_X2,0402_CC; CAD_APPROVED: Yes; MFG_PN01: RC-01000JT; MFG_NAME01: FENGHUA; Tolerance: 5%; VOLTAGE: 1/16W; Value: 0R; ROHS: Yes; HEIGHT: 0.45 MM; PCB Footprint: R0201
R2857 = RES: 0201,0Ohm,+/-5%; Part Reference: R2857; CLASS: DISCRETE; FPLIST: RC0402_25,RC0402_HD,RC0402_X2,0402_CC; CAD_APPROVED: Yes; MFG_PN01: RC-01000JT; MFG_NAME01: FENGHUA; Tolerance: 5%; VOLTAGE: 1/16W; Value: 0R; ROHS: Yes; HEIGHT: 0.45 MM; PCB Footprint: R0201
R2858 = RES: 0201,0Ohm,+/-5%; Part Reference: R2858; CLASS: DISCRETE; VOLTAGE: 1/16W; Tolerance: 5%; MFG_NAME01: FENGHUA; MFG_PN01: RC-01000JT; CAD_APPROVED: Yes; FPLIST: RC0402_25,RC0402_HD,RC0402_X2,0402_CC; Value: 0R; HEIGHT: 0.45 MM; ROHS: Yes; PCB Footprint: R0201
R2859 = RES: 0201,10K,+/-5%; Part Reference: R2859; CLASS: DISCRETE; FPLIST: RC0402_25,RC0402_HD,0402_CC; CAD_APPROVED: Yes; MFG_PN01: RC-01W103JT; MFG_NAME01: FENGHUA; Value: 10K; HEIGHT: 0.4 MM; ROHS: Yes; PCB Footprint: R0201
R2860 = RES: 0402,0Ohm,+/-1%; Part Reference: R2860; CLASS: DISCRETE; FPLIST: RC0402_25,RC0402_HD,RC0402_X2,0402_CC; CAD_APPROVED: Yes; MFG_PN01: RC-02000FT; MFG_NAME01: FENGHUA; Tolerance: 5%; VOLTAGE: 1/16W; Value: 0R; ROHS: Yes; HEIGHT: 0.45 MM; PCB Footprint: R0402
R2861 = RES: 0201,0Ohm,+/-5%; Part Reference: R2861; CLASS: DISCRETE; FPLIST: RC0402_25,RC0402_HD,RC0402_X2,0402_CC; CAD_APPROVED: Yes; MFG_PN01: RC-01000JT; MFG_NAME01: FENGHUA; Tolerance: 5%; VOLTAGE: 1/16W; Value: 0R; ROHS: Yes; HEIGHT: 0.45 MM; PCB Footprint: R0201
R2862 = RES: 0201,10K,+/-5%; Part Reference: R2862; CLASS: DISCRETE; FPLIST: RC0402_25,RC0402_HD,0402_CC; CAD_APPROVED: Yes; MFG_PN01: RC-01W103JT; MFG_NAME01: FENGHUA; Value: 10K; HEIGHT: 0.4 MM; ROHS: Yes; PCB Footprint: R0201
R2863 = RES: 0201,0Ohm,+/-5%; Part Reference: R2863; CLASS: DISCRETE; FPLIST: RC0402_25,RC0402_HD,RC0402_X2,0402_CC; CAD_APPROVED: Yes; MFG_PN01: RC-01000JT; MFG_NAME01: FENGHUA; Tolerance: 5%; VOLTAGE: 1/16W; Value: 0R; ROHS: Yes; HEIGHT: 0.45 MM; PCB Footprint: R0201
R2864 = RES: 0201,100Ohm,+/-1%; Part Reference: R2864; CLASS: DISCRETE; MFG_PN01: RC-01W1000FT; MFG_NAME01: FENGHUA; Temp Range: -55¡ãC to +175¡ãC; CAD_APPROVED: Yes; Tolerance: 5%; FPLIST: RC0402_25,RC0402_HD,RC0402_X2,0402_CC; Value: 100R; ROHS: Yes; HEIGHT: 0.45MM; PCB Footprint: R0201
R2865 = RES: 0201,0Ohm,+/-5%; Part Reference: R2865; CLASS: DISCRETE; FPLIST: RC0402_25,RC0402_HD,RC0402_X2,0402_CC; CAD_APPROVED: Yes; MFG_PN01: RC-01000JT; MFG_NAME01: FENGHUA; Tolerance: 5%; VOLTAGE: 1/16W; Value: 0R; ROHS: Yes; HEIGHT: 0.45 MM; PCB Footprint: R0201
R2866 = RES: 0402,0Ohm,+/-1%; Part Reference: R2866; CLASS: DISCRETE; FPLIST: RC0402_25,RC0402_HD,RC0402_X2,0402_CC; CAD_APPROVED: Yes; MFG_PN01: RC-02000FT; MFG_NAME01: FENGHUA; Tolerance: 5%; VOLTAGE: 1/16W; Value: 0R; ROHS: Yes; HEIGHT: 0.45 MM; PCB Footprint: R0402
R2867 = RES: 0402,0Ohm,+/-1%; Part Reference: R2867; CLASS: DISCRETE; VOLTAGE: 1/16W; Tolerance: 5%; MFG_NAME01: FENGHUA; MFG_PN01: RC-02000FT; CAD_APPROVED: Yes; FPLIST: RC0402_25,RC0402_HD,RC0402_X2,0402_CC; Value: 0R; HEIGHT: 0.45 MM; ROHS: Yes; PCB Footprint: R0402
R2868 = RES: 0201,0Ohm,+/-5%; Part Reference: R2868; CLASS: DISCRETE; FPLIST: RC0402_25,RC0402_HD,RC0402_X2,0402_CC; CAD_APPROVED: Yes; MFG_PN01: RC-01000JT; MFG_NAME01: FENGHUA; Tolerance: 5%; VOLTAGE: 1/16W; Value: 0R; ROHS: Yes; HEIGHT: 0.45 MM; PCB Footprint: R0201
R2870 = RES: 0402,0Ohm,+/-1%; Part Reference: R2870; CLASS: DISCRETE; VOLTAGE: 1/16W; Tolerance: 5%; MFG_NAME01: FENGHUA; MFG_PN01: RC-02000FT; CAD_APPROVED: Yes; FPLIST: RC0402_25,RC0402_HD,RC0402_X2,0402_CC; Value: 0R; HEIGHT: 0.45 MM; ROHS: Yes; PCB Footprint: R0402
R2871 = RES: 0402,0Ohm,+/-1%; Part Reference: R2871; CLASS: DISCRETE; VOLTAGE: 1/16W; Tolerance: 5%; MFG_NAME01: FENGHUA; MFG_PN01: RC-02000FT; CAD_APPROVED: Yes; FPLIST: RC0402_25,RC0402_HD,RC0402_X2,0402_CC; Value: 0R; HEIGHT: 0.45 MM; ROHS: Yes; PCB Footprint: R0402
R2873 = RES: 0201,10K,+/-5%; Part Reference: R2873; CLASS: DISCRETE; MFG_NAME01: FENGHUA; MFG_PN01: RC-01W103JT; CAD_APPROVED: Yes; FPLIST: RC0402_25,RC0402_HD,0402_CC; Value: 10K; ROHS: Yes; HEIGHT: 0.4 MM; PCB Footprint: R0201
R2954 = RES: 0201,10K,+/-5%; Part Reference: R2954; CLASS: DISCRETE; FPLIST: RC0402_25,RC0402_HD,0402_CC; CAD_APPROVED: Yes; MFG_PN01: RC-01W103JT; MFG_NAME01: FENGHUA; Value: 10K; HEIGHT: 0.4 MM; ROHS: Yes; PCB Footprint: R0201
R2955 = RES: 0201,0Ohm,+/-5%; Part Reference: R2955; CLASS: DISCRETE; FPLIST: RC0402_25,RC0402_HD,RC0402_X2,0402_CC; CAD_APPROVED: Yes; MFG_PN01: RC-01000JT; MFG_NAME01: FENGHUA; Tolerance: 5%; VOLTAGE: 1/16W; Value: 0R; ROHS: Yes; HEIGHT: 0.45 MM; PCB Footprint: R0201
R2956 = RES: 0201,100K,+/-1%; Part Reference: R2956; CLASS: DISCRETE; Tolerance: 5%; MFG_NAME01: FENGHUA; MFG_PN01: RC-01W1003FT; CAD_APPROVED: Yes; FPLIST: RC0402_25,RC0402_HD,0402_CC; Value: 100K; ROHS: Yes; HEIGHT: 0.4 MM; PCB Footprint: R0201
R2957 = RES: 0201,10K,+/-5%; Part Reference: R2957; CLASS: DISCRETE; FPLIST: RC0402_25,RC0402_HD,0402_CC; CAD_APPROVED: Yes; MFG_PN01: RC-01W103JT; MFG_NAME01: FENGHUA; Value: 10K; HEIGHT: 0.4 MM; ROHS: Yes; PCB Footprint: R0201
R2958 = RES: 0201,10K,+/-5%; Part Reference: R2958; CLASS: DISCRETE; MFG_NAME01: FENGHUA; MFG_PN01: RC-01W103JT; CAD_APPROVED: Yes; FPLIST: RC0402_25,RC0402_HD,0402_CC; Value: 10K; ROHS: Yes; HEIGHT: 0.4 MM; PCB Footprint: R0201
R2959 = RES: 0201,0Ohm,+/-5%; Part Reference: R2959; CLASS: DISCRETE; VOLTAGE: 1/16W; Tolerance: 5%; MFG_NAME01: FENGHUA; MFG_PN01: RC-01000JT; CAD_APPROVED: Yes; FPLIST: RC0402_25,RC0402_HD,RC0402_X2,0402_CC; Value: 0R; HEIGHT: 0.45 MM; ROHS: Yes; PCB Footprint: R0201
R2960 = RES: 0201,100K,+/-1%; Part Reference: R2960; CLASS: DISCRETE; Tolerance: 5%; MFG_NAME01: FENGHUA; MFG_PN01: RC-01W1003FT; CAD_APPROVED: Yes; FPLIST: RC0402_25,RC0402_HD,0402_CC; Value: 100K; ROHS: Yes; HEIGHT: 0.4 MM; PCB Footprint: R0201
R2961 = RES: 0201,0Ohm,+/-5%; Part Reference: R2961; CLASS: DISCRETE; FPLIST: RC0402_25,RC0402_HD,RC0402_X2,0402_CC; CAD_APPROVED: Yes; MFG_PN01: RC-01000JT; MFG_NAME01: FENGHUA; Tolerance: 5%; VOLTAGE: 1/16W; Value: 0R; ROHS: Yes; HEIGHT: 0.45 MM; PCB Footprint: R0201
R3017 = RES: 0402,0Ohm,+/-1%; Part Reference: R3017; CLASS: DISCRETE; VOLTAGE: 1/16W; Tolerance: 5%; MFG_NAME01: FENGHUA; MFG_PN01: RC-02000FT; CAD_APPROVED: Yes; FPLIST: RC0402_25,RC0402_HD,RC0402_X2,0402_CC; Value: 0R; HEIGHT: 0.45 MM; ROHS: Yes; PCB Footprint: R0402
R3018 = RES: 0402,0Ohm,+/-1%; Part Reference: R3018; CLASS: DISCRETE; FPLIST: RC0402_25,RC0402_HD,RC0402_X2,0402_CC; CAD_APPROVED: Yes; MFG_PN01: RC-02000FT; MFG_NAME01: FENGHUA; Tolerance: 5%; VOLTAGE: 1/16W; Value: 0R; ROHS: Yes; HEIGHT: 0.45 MM; PCB Footprint: R0402
R3028 = RES: 0402,0Ohm,+/-1%; Part Reference: R3028; CLASS: DISCRETE; FPLIST: RC0402_25,RC0402_HD,RC0402_X2,0402_CC; CAD_APPROVED: Yes; MFG_PN01: RC-02000FT; MFG_NAME01: FENGHUA; Tolerance: 5%; VOLTAGE: 1/16W; Value: 0R; ROHS: Yes; HEIGHT: 0.45 MM; PCB Footprint: R0402
R3031 = RES: 0201,10K,+/-5%; Part Reference: R3031; CLASS: DISCRETE; FPLIST: RC0402_25,RC0402_HD,0402_CC; CAD_APPROVED: Yes; MFG_PN01: RC-01W103JT; MFG_NAME01: FENGHUA; Value: 10K; HEIGHT: 0.4 MM; ROHS: Yes; PCB Footprint: R0201
R3037 = RES: 0402,0Ohm,+/-1%; Part Reference: R3037; CLASS: DISCRETE; VOLTAGE: 1/16W; Tolerance: 5%; MFG_NAME01: FENGHUA; MFG_PN01: RC-02000FT; CAD_APPROVED: Yes; FPLIST: RC0402_25,RC0402_HD,RC0402_X2,0402_CC; Value: 0R; HEIGHT: 0.45 MM; ROHS: Yes; PCB Footprint: R0402
R3038 = RES: 0402,0Ohm,+/-1%; Part Reference: R3038; CLASS: DISCRETE; VOLTAGE: 1/16W; Tolerance: 5%; MFG_NAME01: FENGHUA; MFG_PN01: RC-02000FT; CAD_APPROVED: Yes; FPLIST: RC0402_25,RC0402_HD,RC0402_X2,0402_CC; Value: 0R; HEIGHT: 0.45 MM; ROHS: Yes; PCB Footprint: R0402
TP934 = TESTLOOP: no part to order; Part Reference: TP934; CLASS: IO; ASSY_OPT: DNP; MFG_NAME01: NOT A COMPONENT; CAD_APPROVED: Yes; MFG_PN01: NOT A COMPONENT; ROHS: Yes; HEIGHT: 0.1MM; PCB Footprint: tpad_015
U726 = MP2147GD_QFN_11P: Part Reference: U726; CLASS: IC; CAD_APPROVED: Yes; MFG_NAME01: MPS; Value: MP2147GD; HEIGHT: 1MM; ROHS: Yes; MFG_PN01: MP2147GD; PCB Footprint: qfn12_0p5_2x3mm_ep
U728 = TXB0304RUT_12P_B_0: 74AVC4T3144GU12,XQFN12,1.70*2.0,4-bit dual-supply buffer/level translator;3-state; Part Reference: U728; CLASS: IC; CAD_APPROVED: Yes; VOLTAGE: 0.9-3.6V; MFG_NAME01: NXP; 3D_Mechanical_Footprint_File: ftp://fcl.am.freescale.net/ALLEGRO/step/uqfn12_1p7x2mm.STEP; Value: 74AVC4T3144; HEIGHT: 0.55 MM; ROHS: Yes; MFG_PN01: 74AVC4T3144; PCB Footprint: uqfn12_1p7x2mm
U729 = TXB0304RUT_12P_B_0: 74AVC4T3144GU12,XQFN12,1.70*2.0,4-bit dual-supply buffer/level translator;3-state; Part Reference: U729; CLASS: IC; 3D_Mechanical_Footprint_File: ftp://fcl.am.freescale.net/ALLEGRO/step/uqfn12_1p7x2mm.STEP; MFG_NAME01: NXP; VOLTAGE: 0.9-3.6V; CAD_APPROVED: Yes; Value: 74AVC4T3144; MFG_PN01: 74AVC4T3144; ROHS: Yes; HEIGHT: 0.55 MM; PCB Footprint: uqfn12_1p7x2mm